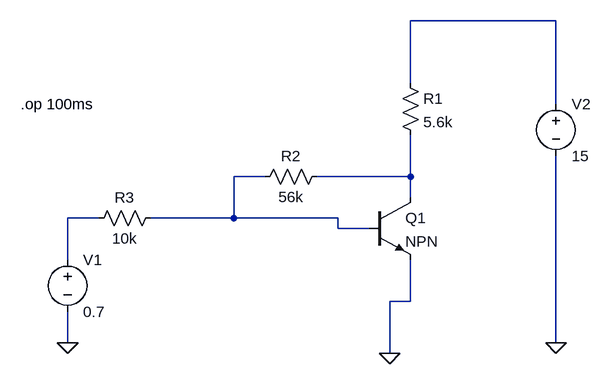
[diagram p0: schematic ee17btech11031.asc]
ee17btech11031.asc, the LTspice schematic file:
Version 4
SHEET 1 880 680
WIRE 304 112 80 112
WIRE 80 208 80 112
WIRE 304 240 304 112
WIRE -144 352 -192 352
WIRE 80 352 80 288
WIRE 80 352 -64 352
WIRE 80 384 80 352
WIRE -400 416 -448 416
WIRE -192 416 -192 352
WIRE -192 416 -320 416
WIRE -32 416 -192 416
WIRE -32 432 -32 416
WIRE 16 432 -32 432
WIRE -448 480 -448 416
WIRE 80 544 80 480
WIRE 80 544 48 544
WIRE -448 608 -448 560
WIRE 304 608 304 320
WIRE 48 624 48 544
FLAG -448 608 0
FLAG 48 624 0
FLAG 304 608 0
SYMBOL res 64 192 R0
SYMATTR InstName R1
SYMATTR Value 5.6k
SYMBOL res -48 336 R90
WINDOW 0 0 56 VBottom 2
WINDOW 3 32 56 VTop 2
SYMATTR InstName R2
SYMATTR Value 56k
SYMBOL res -304 400 R90
WINDOW 0 0 56 VBottom 2
WINDOW 3 32 56 VTop 2
SYMATTR InstName R3
SYMATTR Value 10k
SYMBOL voltage -448 464 R0
WINDOW 123 0 0 Left 0
WINDOW 39 0 0 Left 0
SYMATTR InstName V1
SYMATTR Value 0.7
SYMBOL voltage 304 224 R0
WINDOW 123 0 0 Left 0
WINDOW 39 0 0 Left 0
SYMATTR InstName V2
SYMATTR Value 15
SYMBOL npn 16 384 R0
SYMATTR InstName Q1
TEXT -520 240 Left 2 !.op 100ms

The netlist it stands for:
* ee17btech11031.asc
R1 N001 N003 5.6k
R2 N003 N002 56k
R3 N002 N004 10k
V1 N004 0 0.7
V2 N001 0 15
Q1 N003 N002 0 0 NPN
.model NPN NPN
.model PNP PNP
.lib standard.bjt
.op 100ms
.backanno
.end